# Altium project controller_v1.PrjPcb
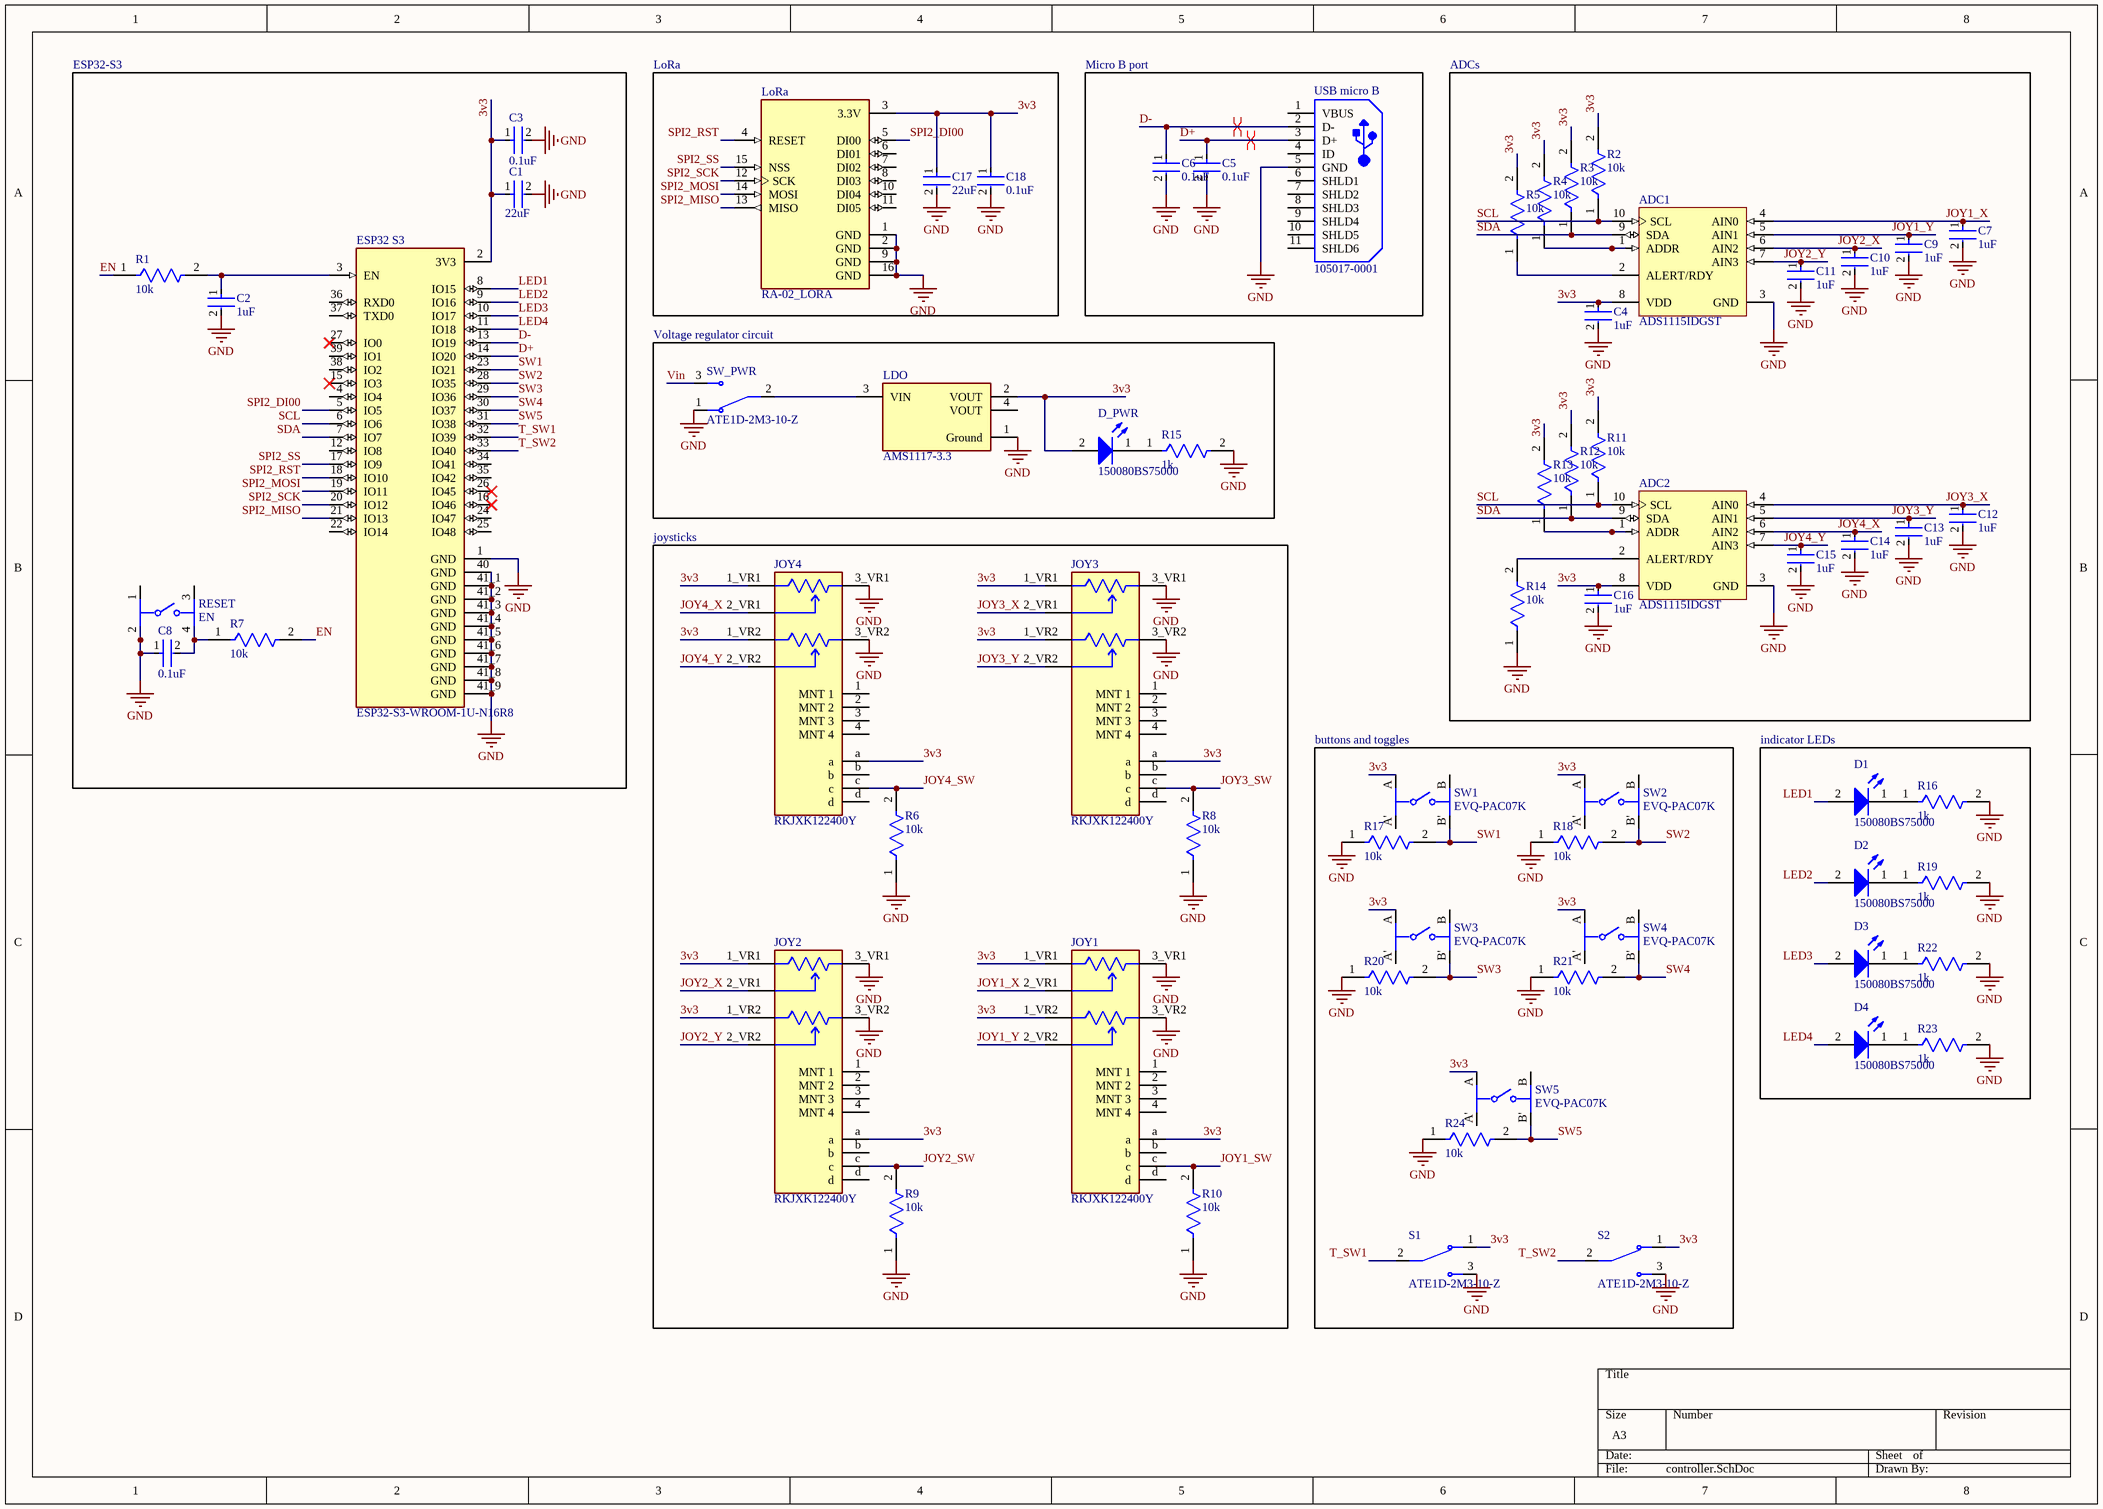
[diagram p0: controller.SchDoc]
1 sheet, 66 parts. Net scope: global (net labels, ports and power ports of the same name join across sheets).

## Sheet controller.SchDoc
size A3; SheetNumber: 1; SheetTotal: 1

### Parts
ADC1  ADS1115IDGST  [TI-DGS10_M]
ADC2  ADS1115IDGST  [TI-DGS10_M]
C1  22uF  [FP-0805-L_2_01_0_2-W_1_25-IPC_B]
C2  1uF  [FP-0805-L_2_01_0_2-W_1_25-IPC_B]
C3  0.1uF  [FP-0805-L_2_01_0_2-W_1_25-IPC_C]
C4  1uF  [FP-0805-L_2_01_0_2-W_1_25-IPC_B]
C5  0.1uF  [FP-0805-L_2_01_0_2-W_1_25-IPC_C]
C6  0.1uF  [FP-0805-L_2_01_0_2-W_1_25-IPC_C]
C7  1uF  [FP-0805-L_2_01_0_2-W_1_25-IPC_B]
C8  0.1uF  [FP-0805-L_2_01_0_2-W_1_25-IPC_C]
C9  1uF  [FP-0805-L_2_01_0_2-W_1_25-IPC_B]
C10  1uF  [FP-0805-L_2_01_0_2-W_1_25-IPC_B]
C11  1uF  [FP-0805-L_2_01_0_2-W_1_25-IPC_B]
C12  1uF  [FP-0805-L_2_01_0_2-W_1_25-IPC_B]
C13  1uF  [FP-0805-L_2_01_0_2-W_1_25-IPC_B]
C14  1uF  [FP-0805-L_2_01_0_2-W_1_25-IPC_B]
C15  1uF  [FP-0805-L_2_01_0_2-W_1_25-IPC_B]
C16  1uF  [FP-0805-L_2_01_0_2-W_1_25-IPC_B]
C17  22uF  [FP-0805-L_2_01_0_2-W_1_25-IPC_B]
C18  0.1uF  [FP-0805-L_2_01_0_2-W_1_25-IPC_C]
D1  150080BS75000  [WL-SMCW_0805_150080xx75000]
D2  150080BS75000  [WL-SMCW_0805_150080xx75000]
D3  150080BS75000  [WL-SMCW_0805_150080xx75000]
D4  150080BS75000  [WL-SMCW_0805_150080xx75000]
D_PWR  150080BS75000  [WL-SMCW_0805_150080xx75000]
ESP32_S3  ESP32-S3-WROOM-1U-N16R8  [XCVR_ESP32-S3-WROOM-1U-N16R8]
JOY1  RKJXK122400Y  [FP-RKJXK122400Y-MFG]
JOY2  RKJXK122400Y  [FP-RKJXK122400Y-MFG]
JOY3  RKJXK122400Y  [FP-RKJXK122400Y-MFG]
JOY4  RKJXK122400Y  [FP-RKJXK122400Y-MFG]
LDO  AMS1117-3.3  [FP-AMS1117-IPC_C]
LoRa  RA-02_LORA  [MODULE_RA-02_LORA]
R1  10k  [FP-CRCW0805-e3-IPC_A]
R2  10k  [FP-CRCW0805-e3-IPC_A]
R3  10k  [FP-CRCW0805-e3-IPC_A]
R4  10k  [FP-CRCW0805-e3-IPC_A]
R5  10k  [FP-CRCW0805-e3-IPC_A]
R6  10k  [FP-CRCW0805-e3-IPC_A]
R7  10k  [FP-CRCW0805-e3-IPC_A]
R8  10k  [FP-CRCW0805-e3-IPC_A]
R9  10k  [FP-CRCW0805-e3-IPC_A]
R10  10k  [FP-CRCW0805-e3-IPC_A]
R11  10k  [FP-CRCW0805-e3-IPC_A]
R12  10k  [FP-CRCW0805-e3-IPC_A]
R13  10k  [FP-CRCW0805-e3-IPC_A]
R14  10k  [FP-CRCW0805-e3-IPC_A]
R15  1k  [FP-CRCW0805-e3-MFG]
R16  1k  [FP-CRCW0805-e3-MFG]
R17  10k  [FP-CRCW0805-e3-IPC_A]
R18  10k  [FP-CRCW0805-e3-IPC_A]
R19  1k  [FP-CRCW0805-e3-MFG]
R20  10k  [FP-CRCW0805-e3-IPC_A]
R21  10k  [FP-CRCW0805-e3-IPC_A]
R22  1k  [FP-CRCW0805-e3-MFG]
R23  1k  [FP-CRCW0805-e3-MFG]
R24  10k  [FP-CRCW0805-e3-IPC_A]
RESET  EN  [FP-FSM2JSMAA-MFG]
S1  ATE1D-2M3-10-Z  [SW_ATE1D-2M3-10-Z]
S2  ATE1D-2M3-10-Z  [SW_ATE1D-2M3-10-Z]
SW1  EVQ-PAC07K  [FP-EVQ-PAC07K-MFG]
SW2  EVQ-PAC07K  [FP-EVQ-PAC07K-MFG]
SW3  EVQ-PAC07K  [FP-EVQ-PAC07K-MFG]
SW4  EVQ-PAC07K  [FP-EVQ-PAC07K-MFG]
SW5  EVQ-PAC07K  [FP-EVQ-PAC07K-MFG]
SW_PWR  ATE1D-2M3-10-Z  [SW_ATE1D-2M3-10-Z]
USB_micro_B  105017-0001  [USB-MICRO-B_V]

### Blocks framed on the sheet
ESP32-S3: C1-C3 C8 ESP32_S3 R1 R7 RESET
LoRa: C17 C18 LoRa
Micro B port: C5 C6 USB_micro_B
ADCs: ADC1 ADC2 C4 C7 C9-C16 R2-R5 R11-R14
Voltage regulator circuit: D_PWR LDO R15 SW_PWR
joysticks: JOY1-JOY4 R6 R8-R10
buttons and toggles: R17 R18 R20 R21 R24 S1 S2 SW1-SW5
indicator LEDs: D1-D4 R16 R19 R22 R23

### Nets
GND: ADC1.3(GND) ADC2.3(GND) C1.2 C2.2 C3.2 C4.2 C5.2 C6.2 C7.2 C8.1 C9.2 C10.2 C11.2 C12.2 C13.2 C14.2 C15.2 C16.2 C17.2 C18.2 ESP32_S3.1(GND) ESP32_S3.40(GND) ESP32_S3.41_1(GND) ESP32_S3.41_2(GND) ESP32_S3.41_3(GND) ESP32_S3.41_4(GND) ESP32_S3.41_5(GND) ESP32_S3.41_6(GND) ESP32_S3.41_7(GND) ESP32_S3.41_8(GND) ESP32_S3.41_9(GND) JOY1.3_VR1(3_VR1) JOY1.3_VR2(3_VR2) JOY2.3_VR1(3_VR1) JOY2.3_VR2(3_VR2) JOY3.3_VR1(3_VR1) JOY3.3_VR2(3_VR2) JOY4.3_VR1(3_VR1) JOY4.3_VR2(3_VR2) LDO.1(Ground) LoRa.1(GND) LoRa.2(GND) LoRa.9(GND) LoRa.16(GND) R6.1 R8.1 R9.1 R10.1 R14.1 R15.2 R16.2 R17.1 R18.1 R19.2 R20.1 R21.1 R22.2 R23.2 R24.1 RESET.2 S1.3 S2.3 SW_PWR.1 USB_micro_B.5(GND)
3v3: ADC1.8(VDD) ADC2.8(VDD) C1.1 C3.1 C4.1 C16.1 C17.1 C18.1 D_PWR.2(A) ESP32_S3.2(3V3) JOY1.1_VR1(1_VR1) JOY1.1_VR2(1_VR2) JOY1.a JOY2.1_VR1(1_VR1) JOY2.1_VR2(1_VR2) JOY2.a JOY3.1_VR1(1_VR1) JOY3.1_VR2(1_VR2) JOY3.a JOY4.1_VR1(1_VR1) JOY4.1_VR2(1_VR2) JOY4.a LDO.2(VOUT) LoRa.3(3.3V) R2.2 R3.2 R4.2 R5.2 R11.2 R12.2 R13.2 S1.1 S2.1 SW1.A SW2.A SW3.A SW4.A SW5.A
D+: C5.1 ESP32_S3.14(IO20) USB_micro_B.3(D+)
D-: C6.1 ESP32_S3.13(IO19) USB_micro_B.2(D-)
EN: R1.1 R7.2
JOY1_SW: JOY1.c R10.2
JOY1_X: ADC1.4(AIN0) C7.1 JOY1.2_VR1(2_VR1)
JOY1_Y: ADC1.5(AIN1) C9.1 JOY1.2_VR2(2_VR2)
JOY2_SW: JOY2.c R9.2
JOY2_X: ADC1.6(AIN2) C10.1 JOY2.2_VR1(2_VR1)
JOY2_Y: ADC1.7(AIN3) C11.1 JOY2.2_VR2(2_VR2)
JOY3_SW: JOY3.c R8.2
JOY3_X: ADC2.4(AIN0) C12.1 JOY3.2_VR1(2_VR1)
JOY3_Y: ADC2.5(AIN1) C13.1 JOY3.2_VR2(2_VR2)
JOY4_SW: JOY4.c R6.2
JOY4_X: ADC2.6(AIN2) C14.1 JOY4.2_VR1(2_VR1)
JOY4_Y: ADC2.7(AIN3) C15.1 JOY4.2_VR2(2_VR2)
LED1: D1.2(A) ESP32_S3.8(IO15)
LED2: D2.2(A) ESP32_S3.9(IO16)
LED3: D3.2(A) ESP32_S3.10(IO17)
LED4: D4.2(A) ESP32_S3.11(IO18)
SCL: ADC1.10(SCL) ADC2.10(SCL) ESP32_S3.6(IO6) R2.1 R11.1
SDA: ADC1.9(SDA) ADC2.9(SDA) ESP32_S3.7(IO7) R3.1 R12.1
SPI2_DI00: ESP32_S3.5(IO5) LoRa.5(DI00)
SPI2_MISO: ESP32_S3.21(IO13) LoRa.13(MISO)
SPI2_MOSI: ESP32_S3.19(IO11) LoRa.14(MOSI)
SPI2_RST: ESP32_S3.18(IO10) LoRa.4(RESET)
SPI2_SCK: ESP32_S3.20(IO12) LoRa.12(SCK)
SPI2_SS: ESP32_S3.17(IO9) LoRa.15(NSS)
SW1: ESP32_S3.23(IO21) R17.2 SW1.B'
SW2: ESP32_S3.28(IO35) R18.2 SW2.B'
SW3: ESP32_S3.29(IO36) R20.2 SW3.B'
SW4: ESP32_S3.30(IO37) R21.2 SW4.B'
SW5: ESP32_S3.31(IO38) R24.2 SW5.B'
T_SW1: ESP32_S3.32(IO39) S1.2
T_SW2: ESP32_S3.33(IO40) S2.2
Vin: SW_PWR.3
NetADC1_1: ADC1.1(ADDR) R4.1
NetADC1_2: ADC1.2(ALERT/RDY) R5.1
NetADC2_1: ADC2.1(ADDR) R13.1
NetADC2_2: ADC2.2(ALERT/RDY) R14.2
NetC2_1: C2.1 ESP32_S3.3(EN) R1.2
NetC8_2: C8.2 R7.1 RESET.4
NetD1_1: D1.1(K) R16.1
NetD2_1: D2.1(K) R19.1
NetD3_1: D3.1(K) R22.1
NetD4_1: D4.1(K) R23.1
NetD_PWR_1: D_PWR.1(K) R15.1
NetLDO_3: LDO.3(VIN) SW_PWR.2

Not connected (* = marked no-connect by the designer): ESP32_S3 4(IO4) 12(IO8) 15(IO3)* 16(IO46)* 22(IO14) 24(IO47) 25(IO48) 26(IO45)* 27(IO0)* 34(IO41) 35(IO42) 36(RXD0) 37(TXD0) 38(IO2) 39(IO1); JOY1 1(MNT_1) 2(MNT_2) 3(MNT_3) 4(MNT_4) b d; JOY2 1(MNT_1) 2(MNT_2) 3(MNT_3) 4(MNT_4) b d; JOY3 1(MNT_1) 2(MNT_2) 3(MNT_3) 4(MNT_4) b d; JOY4 1(MNT_1) 2(MNT_2) 3(MNT_3) 4(MNT_4) b d; LDO 4(VOUT); LoRa 6(DI01) 7(DI02) 8(DI03) 10(DI04) 11(DI05); RESET 1 3; SW1 A' B; SW2 A' B; SW3 A' B; SW4 A' B; SW5 A' B; USB_micro_B 1(VBUS) 4(ID) 6(SHLD1) 7(SHLD2) 8(SHLD3) 9(SHLD4) 10(SHLD5) 11(SHLD6)

### Layout directives
differential pair: D+, D-

### Library data of the parts
ADC1 ADC2 = CMP-0003-00378-2: 16-Bit ADC with Integrated Multiplexer, PGA, Comparator, Oscillator, and Reference, -40 to 125 degC, 10-pin SOP (DGS10), Green (RoHS & no Sb/Br); Manufacturer: Texas Instruments; Sample Rate (max)(SPS): 860; SubFamily: Precision ADC (<=10MSPS); Architecture: Delta-Sigma; Digital Supply(Min)(V): 2; Resolution(Bits): 16; Digital Supply(Max)(V): 5.5; INL(Max)(+/-LSB): 1; Interface: Serial I2C; # Input Channels: 4; Eco-Plan: Green (RoHS & no Sb/Br); PackageDescription: 10-Pin Plastic Small Outline, Body 3 x 3 mm, Pitch 0.5 mm; Mounting Technology: Surface Mount; PackageReference: DGS10; DatasheetVersion: SBAS444B; ComponentLink3Description: Package Specification; ComponentLink1Description: Manufacturer URL; PartNumber: ADS1115IDGST; ComponentLink3URL: http://www.ti.com/lit/ml/mpds035b/mpds035b.pdf; ComponentLink2URL: http://www.ti.com/general/docs/lit/getliterature.tsp?genericPartNumber=ADS1115&fileType=pdf; Analog Voltage AV/DD(Min)(V): 2; ComponentLink2Description: Datasheet; PackageVersion: 4073272/C, 02/2004; Analog Voltage AV/DD(Max)(V): 5.5; Code_JEDEC: MO-153; ComponentLink1URL: http://www.ti.com/
C1 C17 = CMP-1036-04939-3: General Purpose Ceramic Capacitor, 0805, 22uF, 20%, X5R, 15%, 6.3V; Dissipation Factor: 12.5%; Insulation Resistance: 10GR; Dielectric Material: Ceramic; Tolerance: 20%; Max Operating Temperature: 85°C; Min Operating Temperature: -55°C; Package Quantity: 1; Termination: SMD/SMT; Voltage Rating: 6.3V; Voltage: 6.3V; Width: 0.049inch; Mount: Surface Mount; Thickness: 0.055inch; RoHS Compliant: Yes; Lead Free: Lead Free; Packaging: Tape and Reel; Capacitance: 22uF; Depth: 1.25mm; Radiation Hardening: No; Voltage Rating (DC): 6.3V; Number of Pins: 2; Dielectric: X5R; Case/Package: 0805; Length: 2.01mm; Case Code (Metric): 2012; REACH SVHC: No SVHC; Case Code (Imperial): 0805; Height: 1.4mm
C2 C4 C7 C9-C16 = CMP-2007-04599-2: General Purpose Ceramic Capacitor, 0805, 1uF, 10%, X7R, 15%, 25V; Temperature Coefficient: 30ppm/°C; Packaging: Tape and Reel; Min Operating Temperature: -55°C; Contact Plating: Tin; Tolerance: 10%; Radiation Hardening: No; Height: 1.4mm; Case Code (Metric): 2012; Mount: Surface Mount; Lead Free: Lead Free; REACH SVHC: No SVHC; Features: Soft Termination; Voltage Rating (DC): 25V; Length: 2.01mm; Capacitance: 1uF; Thickness: 0.055inch; Series: FLEXITERM®; Case/Package: 0805; Depth: 1.25mm; Number of Pins: 2; Max Operating Temperature: 125°C; Package Quantity: 1; Dielectric: X7R; Construction: Flat; Width: 1.25mm; Case Code (Imperial): 0805; Voltage: 25V; RoHS Compliant: Yes; Termination: SMD/SMT; Voltage Rating: 25V
C3 C5 C6 C8 C18 = CMP-2000-05016-2: General Purpose Ceramic Capacitor, 0805, 100nF, 10%, X7R, 0.15, 50V; Dissipation Factor: 2.5%; Insulation Resistance: 100GR; Voltage Rating (DC): 50V; Package Quantity: 4000; Tolerance: 10%; Voltage Rating: 50V; Dielectric: X7R; Case/Package: 0805; Lead Free: Lead Free; Dielectric Material: Ceramic; Thickness: 0.037inch; Weight: 0.001411oz; Max Operating Temperature: 125°C; REACH SVHC: No SVHC; Mount: Surface Mount; RoHS Compliant: Yes; Depth: 1.25mm; Height: 0.5mm; Case Code (Metric): 2012; Length: 2mm; Termination: Standard; Case Code (Imperial): 0805; Number of Pins: 2; Voltage: 50V; Radiation Hardening: No; Min Operating Temperature: -55°C; Capacitance: 100nF; Width: 1.2mm; Series: MLCC X7R; Packaging: Cut Tape
D1-D4 D_PWR = CMP-1426-00008-7: Led, Blue, 470 Nm, 3.2 V, 30 Ma, 145 Mcd Rohs Compliant: Yes; Dominant Wavelength: 470nm; Max Junction Temperature (Tj): 95°C; Power Dissipation: 105mW; Peak Wavelength: 465nm; Max Reverse Voltage (DC): 5V; Forward Current: 100mA; Test Current: 20mA; Luminous Intensity: 145mcd; Lens Style: Clear, Rectangular; Viewing Angle: 140°; Forward Voltage: 3.2V; Color: Blue; Height: 700µm; Case Code (Imperial): 0805; Width: 1.25mm; REACH SVHC: Unknown; Case/Package: 0805; Lead Free: Lead Free; Mount: Surface Mount; Packaging: Tape and Reel; RoHS: Compliant; Reverse Voltage: 5V; Min Operating Temperature: -40°C; Case Code (Metric): 2012; Wavelength: 470nm; Max Operating Temperature: 85°C; Length: 2mm
ESP32_S3 = ESP32-S3-WROOM-1U-N16R8: Bluetooth, WiFi 802.11b/g/n, Bluetooth v5.0 Transceiver Module 2.4GHz Antenna Not Included, U.FL Surface Mount; MF: Espressif Systems; Package: None; Price: None; Value: *; SnapEDA_Link: https://www.snapeda.com/parts/ESP32-S3-WROOM-1U-N16R8/Espressif+Systems/view-part/?ref=snap; MP: ESP32-S3-WROOM-1U-N16R8; Availability: Unavailable; Check_prices: https://www.snapeda.com/parts/ESP32-S3-WROOM-1U-N16R8/Espressif+Systems/view-part/?ref=eda
JOY1-JOY4 = CMP-24118-000005-1: Res POT 10K Ohm 0.0125W (25.4 X 20.7 X 19.3mm) Pin Bracket Mount/Through Hole Tray; Insulation Resistance: 100MR; Resistance: 10kR; Power Rating: 12.5mW; Current Rating: 50mA; Life (Hours): 100Hour; Type: Potentiometer; Mount: Through Hole; Series: RKJXV/ RKJXK; Packaging: Tray; Radiation Hardening: No; Resistor Type: Potentiometer; Termination: Pin; Height: 12.9mm; Military Standard: Not; Min Operating Temperature: -10°C; Max Operating Temperature: 70°C; Package Quantity: 1000; Contact Current Rating: 50mA; Width: 16mm; Depth: 20.7mm; Length: 16mm; RoHS Compliant: Yes
LDO = CMP-209535-000001-1: LDO Voltage Regulators 1A, 3.3V; Manufacturer: Advanced Monolithic Systems; Dropout Voltage: 1.1V; Output Type: Fixed; Nominal Supply Current: 5mA; Max Power Dissipation: 1.2W; Max Supply Voltage: 15V; Number Of Outputs: 1; Standoff Height: 0.64mm; Max Junction Temp: +125°C; Height: 1.8mm; Package: AMS1117; Device Class L2: Power Management ICs; ComponentLink2Description: Datasheet; ComponentLink2URL: http://www.advanced-monolithic.com/pdf/ds1117.pdf; Category: IC; RoHS: TRUE; Automotive: No; Device Class L1: Integrated Circuits (ICs); Output Current: 1A; Device Class L3: Voltage Regulators - Linear; Temperature: -40°C to +125°C; Output Voltage: 3.3V; Manufacturer Part Number: AMS1117-3.3; Temperature Range Low: -40°C; Octopart: https://octopart.com/ams1117-3.3-advanced+monolithic+systems-25899300; Lead Free: Yes; Ipc Land Pattern Name: SOT229P700X180-4; Temperature Range High: +125°C
LoRa = RA-02_LORA: Ra-02 LoRa RF M5Stack Platform Evaluation Expansion Board; Price: None; Availability: Unavailable; MP: RA-02_LORA; Value: *; Package: None
R1-R14 R17 R18 R20 R21 R24 = CMP-2001-04908-2: RES Thick Film, 10kΩ, 1%, 0.125W, 100ppm/°C, 0805; Resistance: 10kR; Voltage Rating (DC): 150V; Power Rating: 125mW; Weight: 0.000194oz; Package Quantity: 5000; Military Standard: Not; Max Operating Temperature: 155°C; Temperature Coefficient: 100ppm/°C; Contact Plating: Tin; Width: 1.25mm; Height: 0.45mm; Radiation Hardening: No; Tolerance: 1%; Min Operating Temperature: -55°C; Voltage Rating: 150V; Length: 2mm; Depth: 1.25mm; Termination: SMD/SMT; Packaging: Tape and Reel; Case/Package: 0805; Case Code (Metric): 2012; Lead Free: Lead Free; Case Code (Imperial): 0805; Composition: Thick Film
R15 R16 R19 R22 R23 = CMP-2001-03607-2: RES Thick Film, 1.2kΩ, 1%, 0.125W, 100ppm/°C, 0805; Max Power Dissipation: 125mW; Voltage Rating (DC): 150V; Resistance: 1.2kR; Military Standard: Not; Termination: SMD/SMT; Package Quantity: 10; Min Operating Temperature: -55°C; Weight: 0.000194oz; Width: 0.049inch; Voltage Rating: 150V; Temperature Coefficient: 100ppm/°C; Case Code (Imperial): 0805; Packaging: Tape and Reel; Composition: Thick Film; Lead Free: Lead Free; Number of Terminations: 2; Depth: 1.25mm; Power Rating: 125mW; Tolerance: 1%; Radiation Hardening: No; Length: 2mm; Case Code (Metric): 2012; Max Operating Temperature: 155°C; Height: 0.45mm; Features: Automotive AEC-Q200; Contact Plating: Tin; Case/Package: 0805
RESET = CMP-03402-000003-1: SWITCH TACTILE SPST-NO 0.05A 24V; Manufacturer Part Number: FSM2JSMAA; Manufacturer: TE Connectivity; Standoff Height: 0.05mm; Contact Current Rating: 50mA; Electromechanical Life: 100000Cycles; Operating Force: 260gf; Contact Resistance: 100mΩ; Package: 0; Temperature Range High: +85°C; Temperature: -35°C to +85°C; Category: Switch; RoHS: TRUE; Mouser Description: Tactile Switches TACTILE 260G FORCE S; Device Class L1: Electromechanical; Mount: Surface Mount; Height: 4.59mm; ComponentLink2URL: https://www.te.com/commerce/DocumentDelivery/DDEController?Action=showdoc&DocId=Customer+Drawing%7F2-1437565-7%7FV%7Fpdf%7FEnglish%7FENG_CD_2-1437565-7_V.pdf%7F2-1437565-8; Temperature Range Low: -35°C; Voltage Rating Dc: 24V; Lead Free: Yes; Automotive: No; Throw Configuration: SPST-NO; Octopart: https://octopart.com/fsm2jsmaa-te+connectivity-41720620; Device Class L2: Switches; Device Class L3: Pushbutton Switches; ComponentLink2Description: Datasheet; Digikey Description: SWITCH TACTILE SPST-NO 0.05A 24V
S1 S2 SW_PWR = ATE1D-2M3-10-Z: Toggle Switch SPDT Through Hole; MF: Nidec Copal Electronics; Purchase-URL: https://pricing.snapeda.com/search/part/ATE1D-2M3-10-Z/?ref=eda; Package: None; Check_prices: https://www.snapeda.com/parts/ATE1D-2M3-10-Z/Nidec+Copal+Electronics/view-part/?ref=eda; Digi-Key_Part_Number: 563-1157-ND; Value: *; MP: ATE1D-2M3-10-Z; SnapEDA_Link: https://www.snapeda.com/parts/ATE1D-2M3-10-Z/Nidec+Copal+Electronics/view-part/?ref=snap
SW1-SW5 = CMP-00287-39841884-1: EVQ-PAC07K Switch Tactile N.O. SPST Round Button PC Pins 0.02A 15VDC 1N Thru-Hole Bulk; Max Current Rating: 20mA; Mechanical Life: 100kcycles; Contact Resistance: 50mΩ; Number of Positions: 2; Voltage Rating (DC): 15V; Actuator Length: 3.1mm; Illumination Type: Illuminated, Non-Illuminated; Switch Travel: 250µm; Switch Function: Off-Mom; Contact Plating: Gold, Silver; Max Operating Temperature: 70°C; Depth: 7.8mm; Min Operating Temperature: -20°C; Length: 6mm; Radiation Hardening: No; Mount: Through Hole; Operating Force: 1N; Height: 7mm; REACH SVHC: Unknown; Lead Free: Lead Free; Current Rating: 20mA; RoHS: Compliant; Contact Current Rating: 20mA; Width: 6mm; NexarPartId: 39841884; Electrical Life: 100kcycles; Termination: PC Pins; Packaging: Bulk; Life (Cycles): 100kcycles; Max Voltage Rating (DC): 15V; Orientation: Straight; Throw Configuration: SPST; Color: Black
USB_micro_B = CMP-2000-05827-1: Micro-USB B Receptacle, Right Angle, Bottom Mount, Surface Mount, with Solder Tabs, -30 to 85 degC, 5-Pin USB, RoHS, Tape and Reel; Manufacturer: Molex; Featured Product: Micro-USBConnectorsUSBConnectors; Other Names: WM1399DKR; Package Version: Rev. F, 12/2012; Number of Contacts: 5; Connector Type: USB-microB; Catalog Drawings: 1050170001; 3D Model: 105017-0001.stp; Mating Products: WM17145-ND-CABLEMICROUSBBTOSTDA1.0MWM17147-ND-CABLEMICROUSBBTOSTDA2.0MWM17146-ND-CABLEMICROUSBBTOSTDA1.5M; PCN Assembly/Origin: ResinSupplier21/Oct/2015; Voltage - Max: 30V; Online Catalog: Molex-MicroUSB; Manufacturer URL: http://www.molex.com/; Package Description: 5-Leads USB, Micro B, Body 7.5 x 5 mm, Pitch 0.65 mm; Datasheet URL: http://www.molex.com/elqNow/elqRedir.htm?ref=http://www.molex.com/webdocs/datasheets/pdf/en-us/1050170001_IO_CONNECTORS.pdf; Ingress Protection: -; Datasheet Version: 03/2016; Mounting Type: BoardCutout,SurfaceMount,RightAngle; Circuits: 5; Standard Package: 1; Package Reference: MICRO-B; Package URL: http://www.molex.com/pdm_docs/sd/1050170001_sd.pdf; Category: Connectors,Interconnects; Series: -; RoHS Information: 1050170001CertofCompliance; Features: Shielded,SolderRetention; Family: USB,DVI,HDMIConnectors; Specifications: -; Gender: Receptacle; Packaging: Digi-Reel®; Mounting Technology: SurfaceMount